# Altium schematic sheet 05.power.SchDoc
size A4
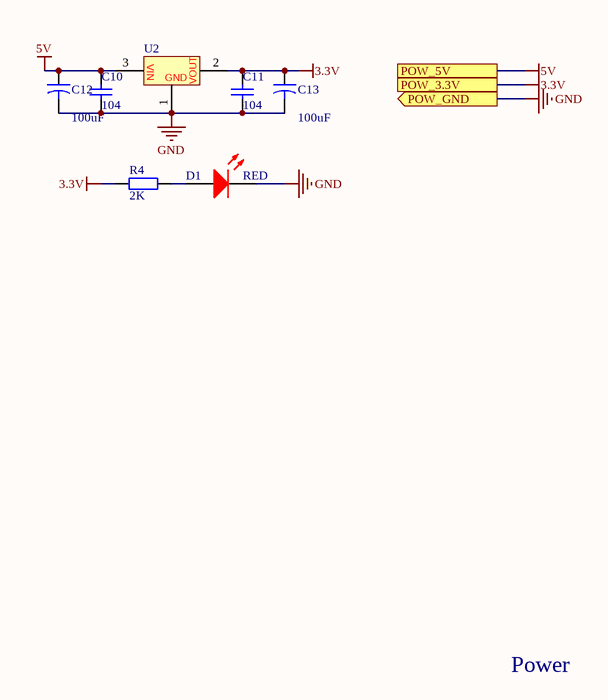
[diagram p0: 05.power.SchDoc]

## Parts
C10  104  [0603C]
C11  104  [0603C]
C12  value 100uF  [3216]  (hidden comment: Cap2)
C13  value 100uF  [3216]  (hidden comment: Cap2)
D1  RED  [0603led]
R4  value 2K  [0603R]  (hidden comment: Res2)
U2  (no value)  [sot-89]

## Ports
POW_3.3V, POW_5V, POW_GND (out)

## Nets
3.3V: C11.2 C13.1 R4.1 U2.2(VOUT) ; port POW_3.3V
5V: C10.2 C12.1 U2.3(VIN) ; port POW_5V
GND: C10.1 C11.1 C12.2 C13.2 D1.2 U2.1(GND) ; port POW_GND
NetD1_1: D1.1 R4.2

## Notes on the sheet
- Power
- #
- 日期
- 描述
- DESIGN BY
- 设计人员
- 设计日期
- 图纸名称
- 图纸描述
- EasyLinker Develop Team
- 审核人员
- 审核日期
- 产品名称
- 产品型号
- 图纸版本
- /
- A4

## Library data of the parts
C10 C11 = Cap: Capacitor; Published: 8-Jun-2000; LatestRevisionDate: 17-Jul-2002; LatestRevisionNote: Re-released for DXP Platform.; PackageReference: RAD-0.3; Publisher: Altium Limited; PackageDescription: Radial Cap, Thru-Hole; 2 Leads; 0.3 in Pin Spacing; Value: 104
C12 C13 = Cap2: Capacitor; Published: 23-Sep-2002; PackageReference: CAPR5-4X5; Publisher: Altium Limited; PackageDescription: Capacitor; 2 Leads
D1 = LED_RED: Typical RED; Published: 8-Jun-2000; LatestRevisionDate: 17-Jul-2002; LatestRevisionNote: Re-released for DXP Platform.; PackageVersion: Feb-2002; PackageReference: 3.2X1.6X1.1; Publisher: Altium Limited; PackageDescription: SM LED; 2 Flat Leads
R4 = Res2: Resistor; Published: 8-Jun-2000; LatestRevisionDate: 17-Jul-2002; LatestRevisionNote: Re-released for DXP Platform.; PackageReference: AXIAL-0.4; Publisher: Altium Limited; PackageDescription: Axial Device, Thru-Hole; 2 Leads; 0.4 in Pin Spacing
U2 = AMS1117